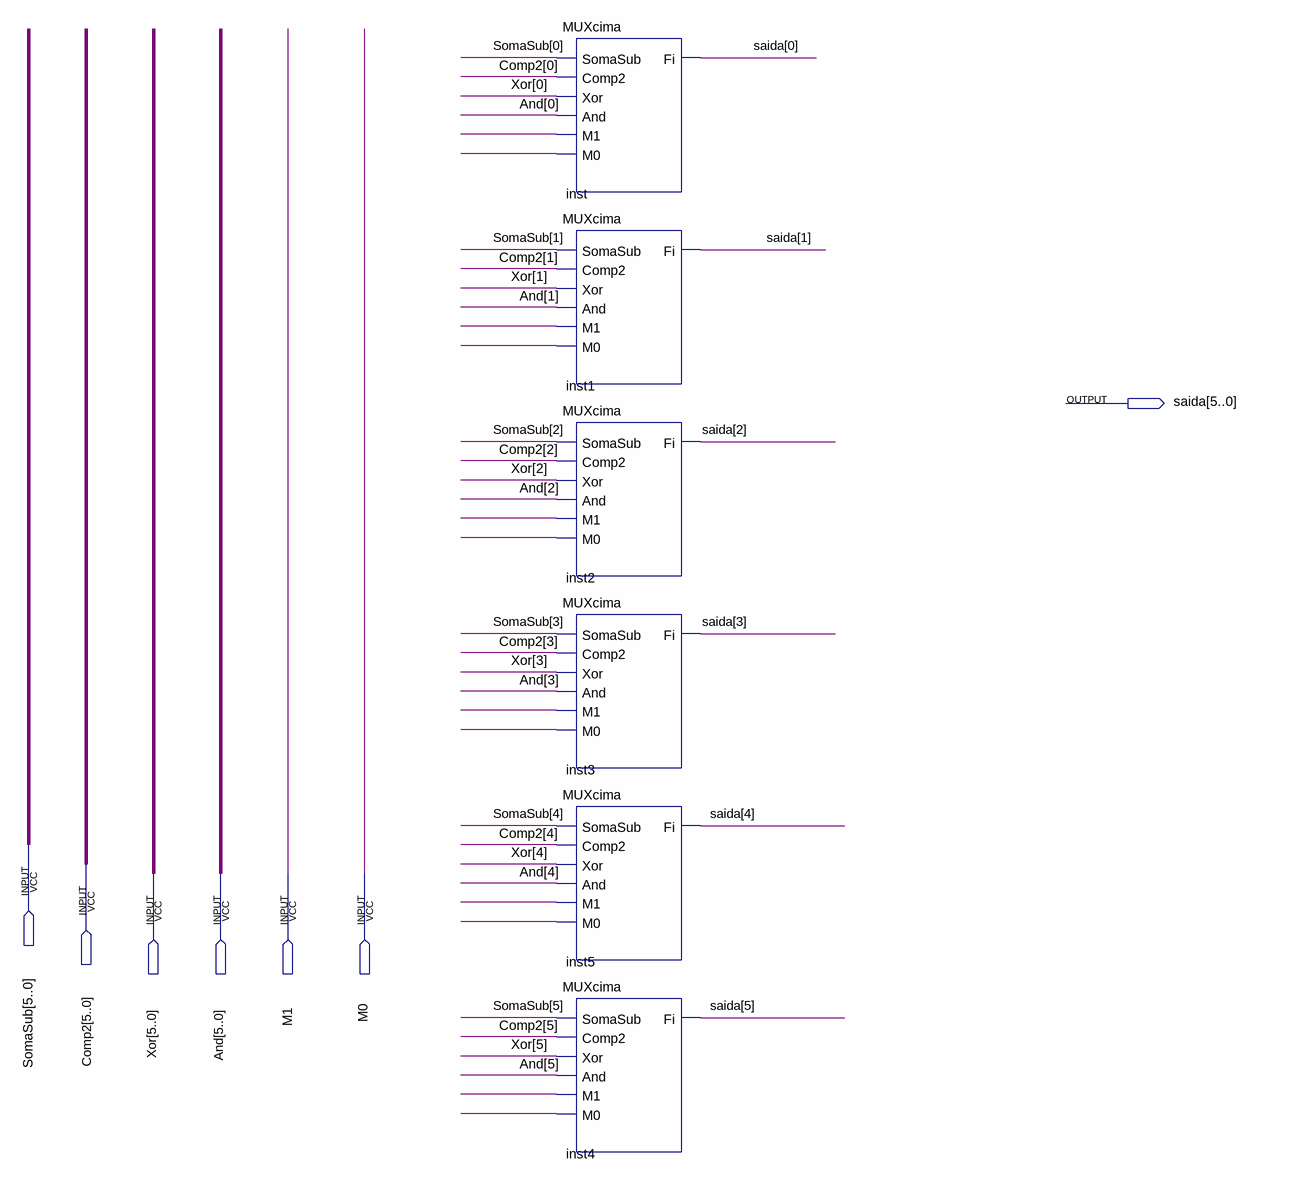
[diagram p0: schematic sheet]
// Quartus schematic Juncao_MUX_CIMA.bdf as structural Verilog: 6 symbols, 7 pins
module Juncao_MUX_CIMA (
  input  [5:0] SomaSub,
  input  [5:0] Comp2,
  input  [5:0] Xor,
  input  [5:0] And,
  input  M1,
  input  M0,
  output [5:0] saida
);

  wire undriven, undriven_2, undriven_3, undriven_4, undriven_5, undriven_6, undriven_7, undriven_8,
       undriven_9, undriven_10, undriven_11, undriven_12;

  MUXcima inst (
    .SomaSub(SomaSub[0]), .Comp2(Comp2[0]), .Xor(Xor[0]), .And(And[0]), .M1(undriven), .M0(undriven_2),
    .Fi(saida[0]));
  MUXcima inst1 (
    .SomaSub(SomaSub[1]), .Comp2(Comp2[1]), .Xor(Xor[1]), .And(And[1]), .M1(undriven_3), .M0(undriven_4),
    .Fi(saida[1]));
  MUXcima inst2 (
    .SomaSub(SomaSub[2]), .Comp2(Comp2[2]), .Xor(Xor[2]), .And(And[2]), .M1(undriven_5), .M0(undriven_6),
    .Fi(saida[2]));
  MUXcima inst3 (
    .SomaSub(SomaSub[3]), .Comp2(Comp2[3]), .Xor(Xor[3]), .And(And[3]), .M1(undriven_7), .M0(undriven_8),
    .Fi(saida[3]));
  MUXcima inst5 (
    .SomaSub(SomaSub[4]), .Comp2(Comp2[4]), .Xor(Xor[4]), .And(And[4]), .M1(undriven_9), .M0(undriven_10),
    .Fi(saida[4]));
  MUXcima inst4 (
    .SomaSub(SomaSub[5]), .Comp2(Comp2[5]), .Xor(Xor[5]), .And(And[5]), .M1(undriven_11), .M0(undriven_12),
    .Fi(saida[5]));
endmodule
